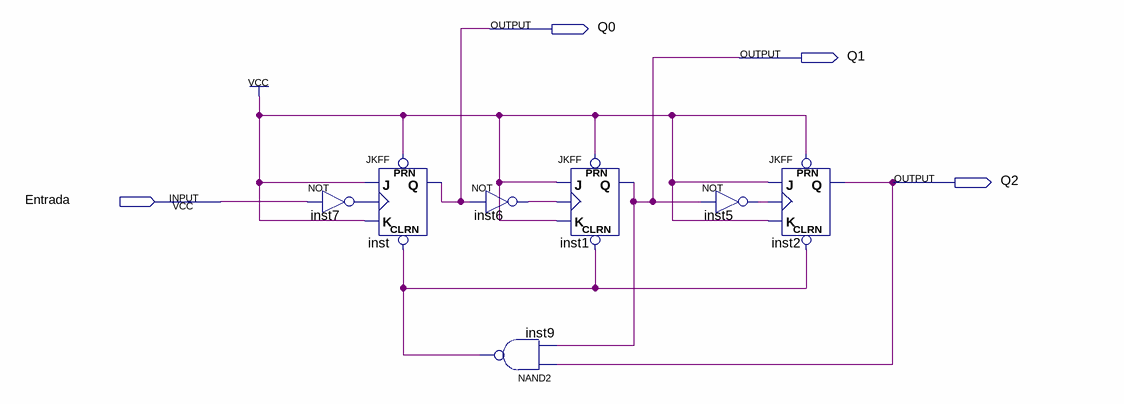
[diagram p0: schematic sheet]
// Quartus schematic Mod6.bdf as structural Verilog: 7 symbols, 4 pins
module Mod6 (
  input  Entrada,
  output Q0,
  output Q1,
  output Q2
);

  wire inst5_out, inst6_out, inst7_out, inst9_out;

  JKFF inst (.PRN(1'b1), .CLRN(inst9_out), .K(1'b1), .J(1'b1), .CLK(inst7_out), .Q(Q0));
  not inst7 (inst7_out, Entrada);
  not inst6 (inst6_out, Q0);
  nand inst9 (inst9_out, Q2, Q1);
  JKFF inst1 (.PRN(1'b1), .CLRN(inst9_out), .K(1'b1), .J(1'b1), .CLK(inst6_out), .Q(Q1));
  not inst5 (inst5_out, Q1);
  JKFF inst2 (.PRN(1'b1), .CLRN(inst9_out), .K(1'b1), .J(1'b1), .CLK(inst5_out), .Q(Q2));
endmodule
